# EAGLE design 02C-001 (EAGLE 9.6.2)
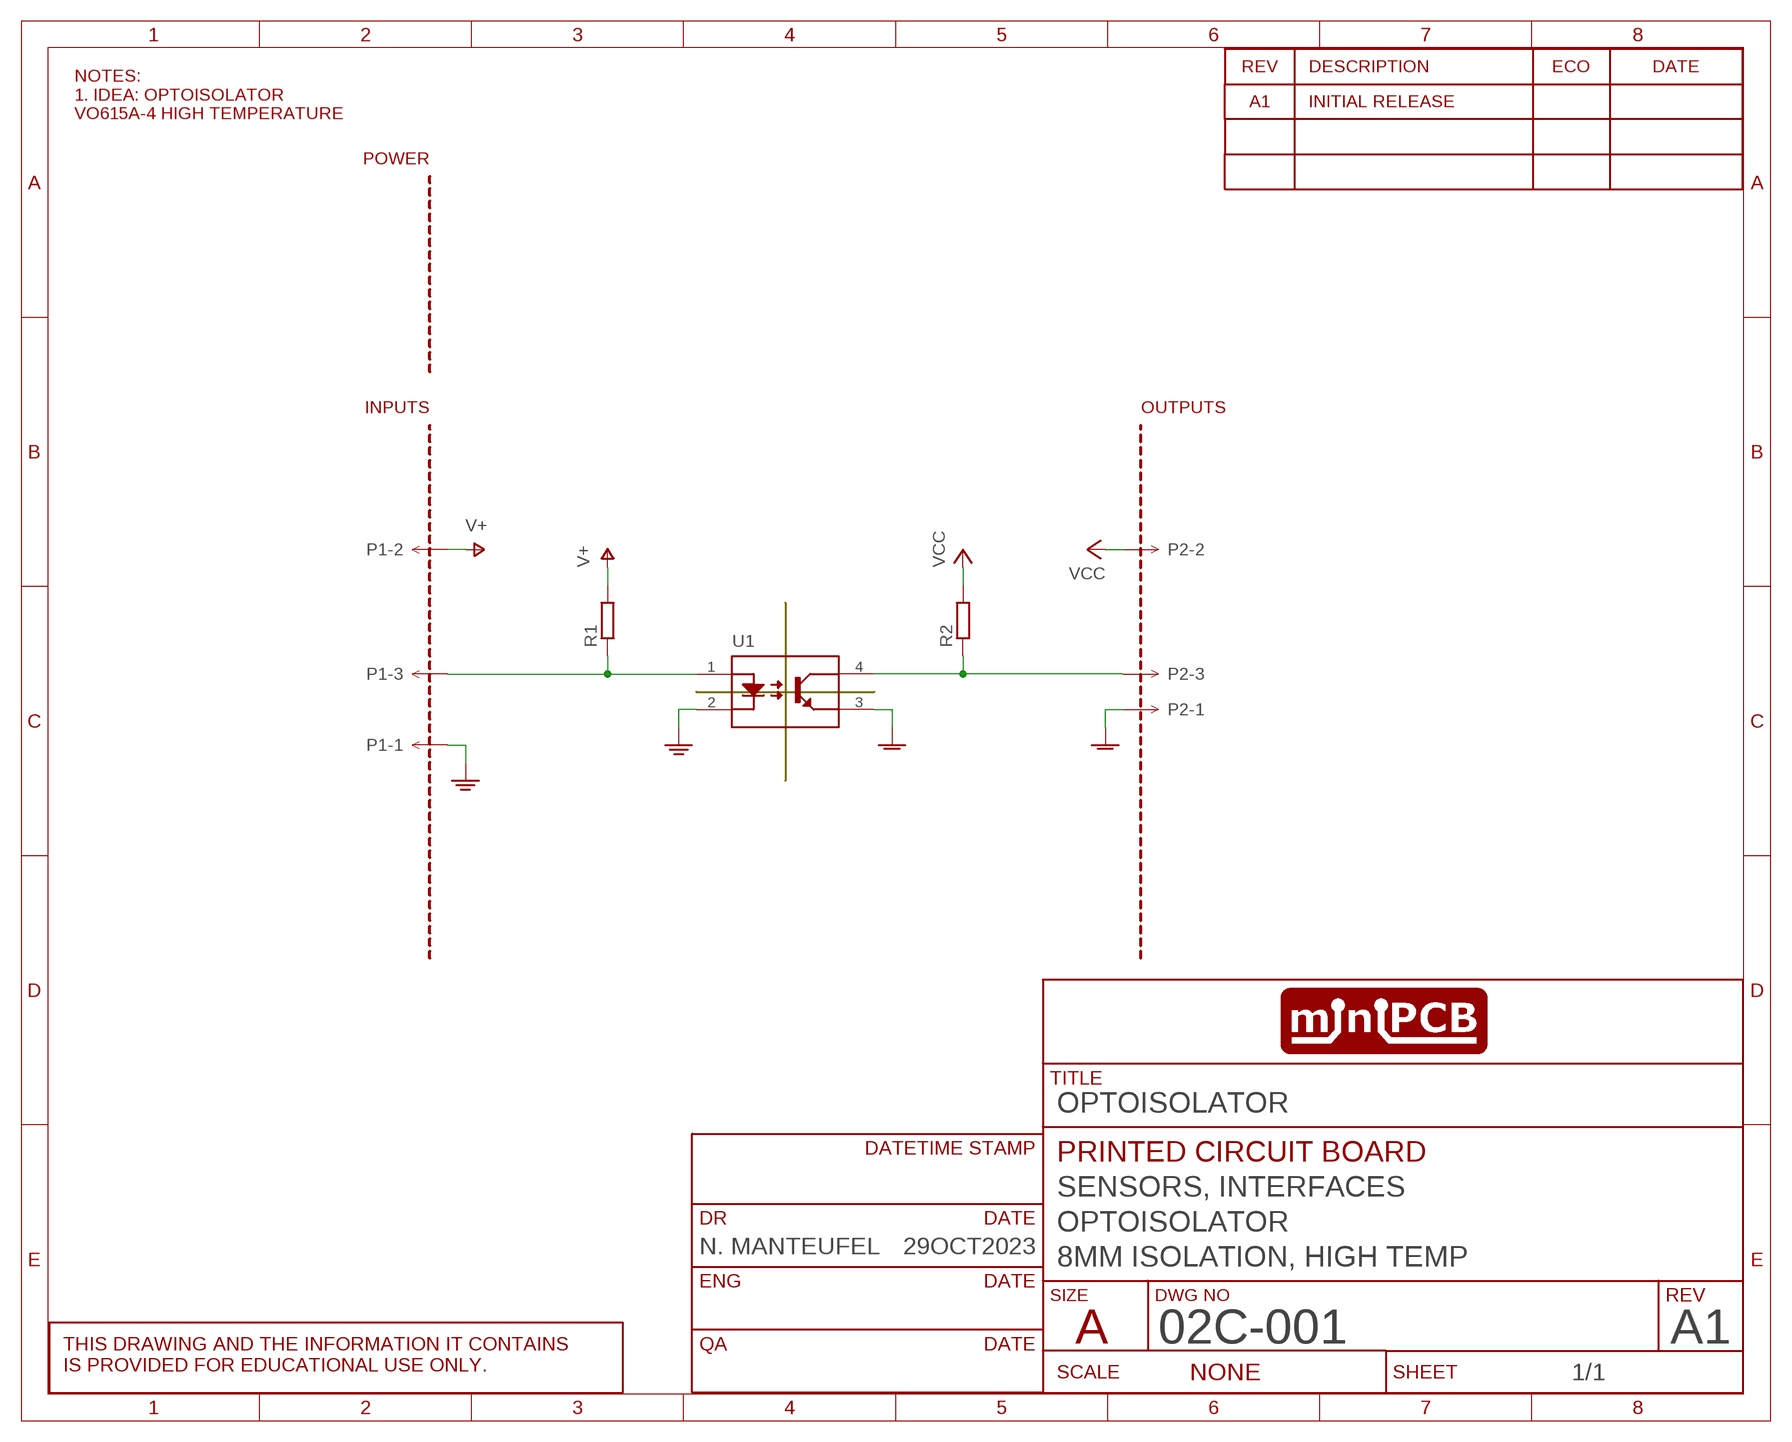
[diagram p0: schematic, sheet 1]
SHEET1 (SCHEMATIC): CIRCUIT_CATEGORY: SENSORS, INTERFACES; CIRCUIT_NAME: OPTOISOLATOR; CIRCUIT_VARIANT: 8MM ISOLATION, HIGH TEMP; DR: N. MANTEUFEL; DR_DATE: 29OCT2023; PCB_PCBA: PRINTED CIRCUIT BOARD; REVA: A1; REVISION: A1; TITLE: OPTOISOLATOR

## Parts
P1  MINIPCB_3P  [PINS_3]
P2  MINIPCB_3P  [PINS_3]
PCB1  MINIPCB_0P00A-20X25  [MINIPCB_00A_20X25]
R1  RESISTORSMD  [R0805]
R2  RESISTORSMD  [R0805]
U1  OPTOCOUPLER8MM  [OPTOCOUPLE]

## Nets
GND: P1.1 U1.2
GNDA: P2.1 U1.3
N$1: P1.3 R1.1 U1.1
N$2: P2.3 R2.1 U1.4
V+: P1.2 R1.2
VCC: P2.2 R2.2

## Notes on the sheet
- NOTES:
  1. IDEA: OPTOISOLATOR
  VO615A-4 HIGH TEMPERATURE

## Library data of the parts
P1 P2 = minipcb:MINIPCB_3P
PCB1 = minipcb:MINIPCB_0P; CIRCUIT_CATEGORY: CIRCUIT CATEGORY; PART_NUMBER: 02C-001; REVISION: A1-01; TITLE: TITLE
R1 R2 = minipcb:RESISTOR
U1 = minipcb:OPTOCOUPLER

## Board
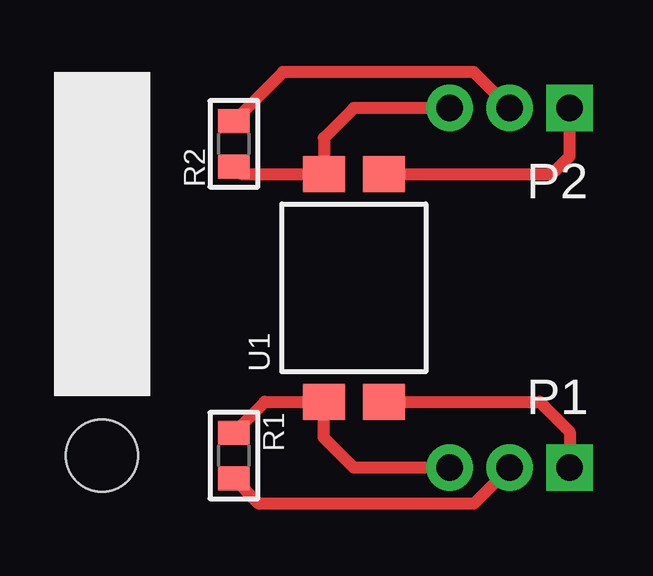
[diagram p1: board, top side]
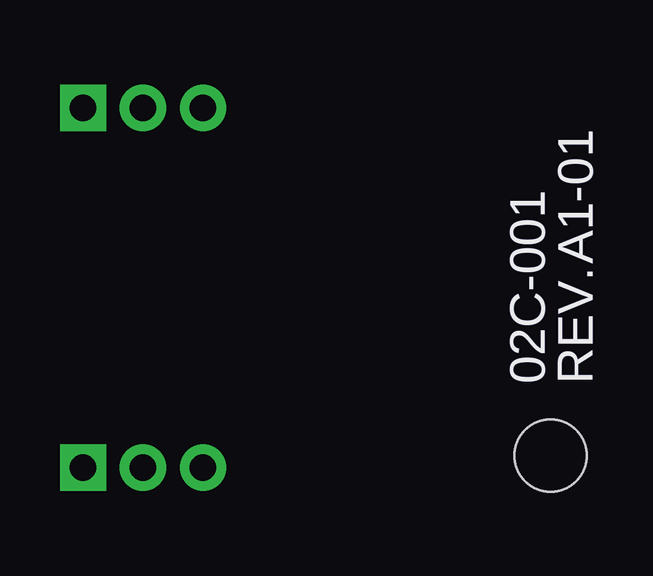
[diagram p2: board, bottom side, seen from below]

No outline drawn. Coordinates in mm, seen from the top.
Copper layers (1*16): Top 0.035mm / dielectric 1.5mm / Bottom 0.035mm
Design rules "default": minimum track width 6mil, minimum drill 0.35mm, track to track 6mil, track to pad 6mil, pad to pad 6mil, via to via 6mil, smd to smd 6mil, copper to edge 40mil, drill to drill 6mil, minimum pad ring 10mil, minimum via ring 8mil, stop-mask expansion 4mil, vias tented up to drill 0mil, thermal gap 10mil

### Footprints (pad centres in the part's own frame; a part is rotated, then mirrored left to right if it is on the bottom)
PINS_3 = drill 1.1 pad 1.93 square: 1 0,0 | drill 1.1 pad 1.93: 2 2.5,0; 3 5,0
MINIPCB_00A_20X25 = hole 3: 3,3
R0805 = smd 1 x 1.3: 1 -0.95,0; 2 0.95,0
OPTOCOUPLE = smd 1.5 x 1.75: 1 -4.75,1.25; 2 -4.75,-1.25; 3 4.75,-1.25; 4 4.75,1.25

### Placement (x,y rotation side)
P1  22.5,2.5 180 top
P2  22.5,17.5 180 top
PCB1  0,0 0 top
R1  8.5,3 270 top
R2  8.5,16 90 top
U1  13.5,10 90 top

### Tracks (layer width: path | path; a pad name or v marks a point on that pad's centre or on a via)
GND
  Top 0.5: U1.2 21.25,5.25 22.5,4 P1.1
GNDA
  Top 0.5: U1.3 21.75,14.75 22.5,15.5 P2.1
N$1
  Top 0.5: P1.3 13.5,2.5 12.25,3.75 U1.1 9.8,5.25 R1.1
N$2
  Top 0.5: P2.3 13.5,17.5 12.25,16.25 U1.4 8.8,14.75 R2.1
V+
  Top 0.5: P1.2 18.5,1 9.55,1 R1.2
VCC
  Top 0.5: P2.2 18.5,19 10.55,19 R2.2